# EAGLE design Macropad (EAGLE 9.6.2)
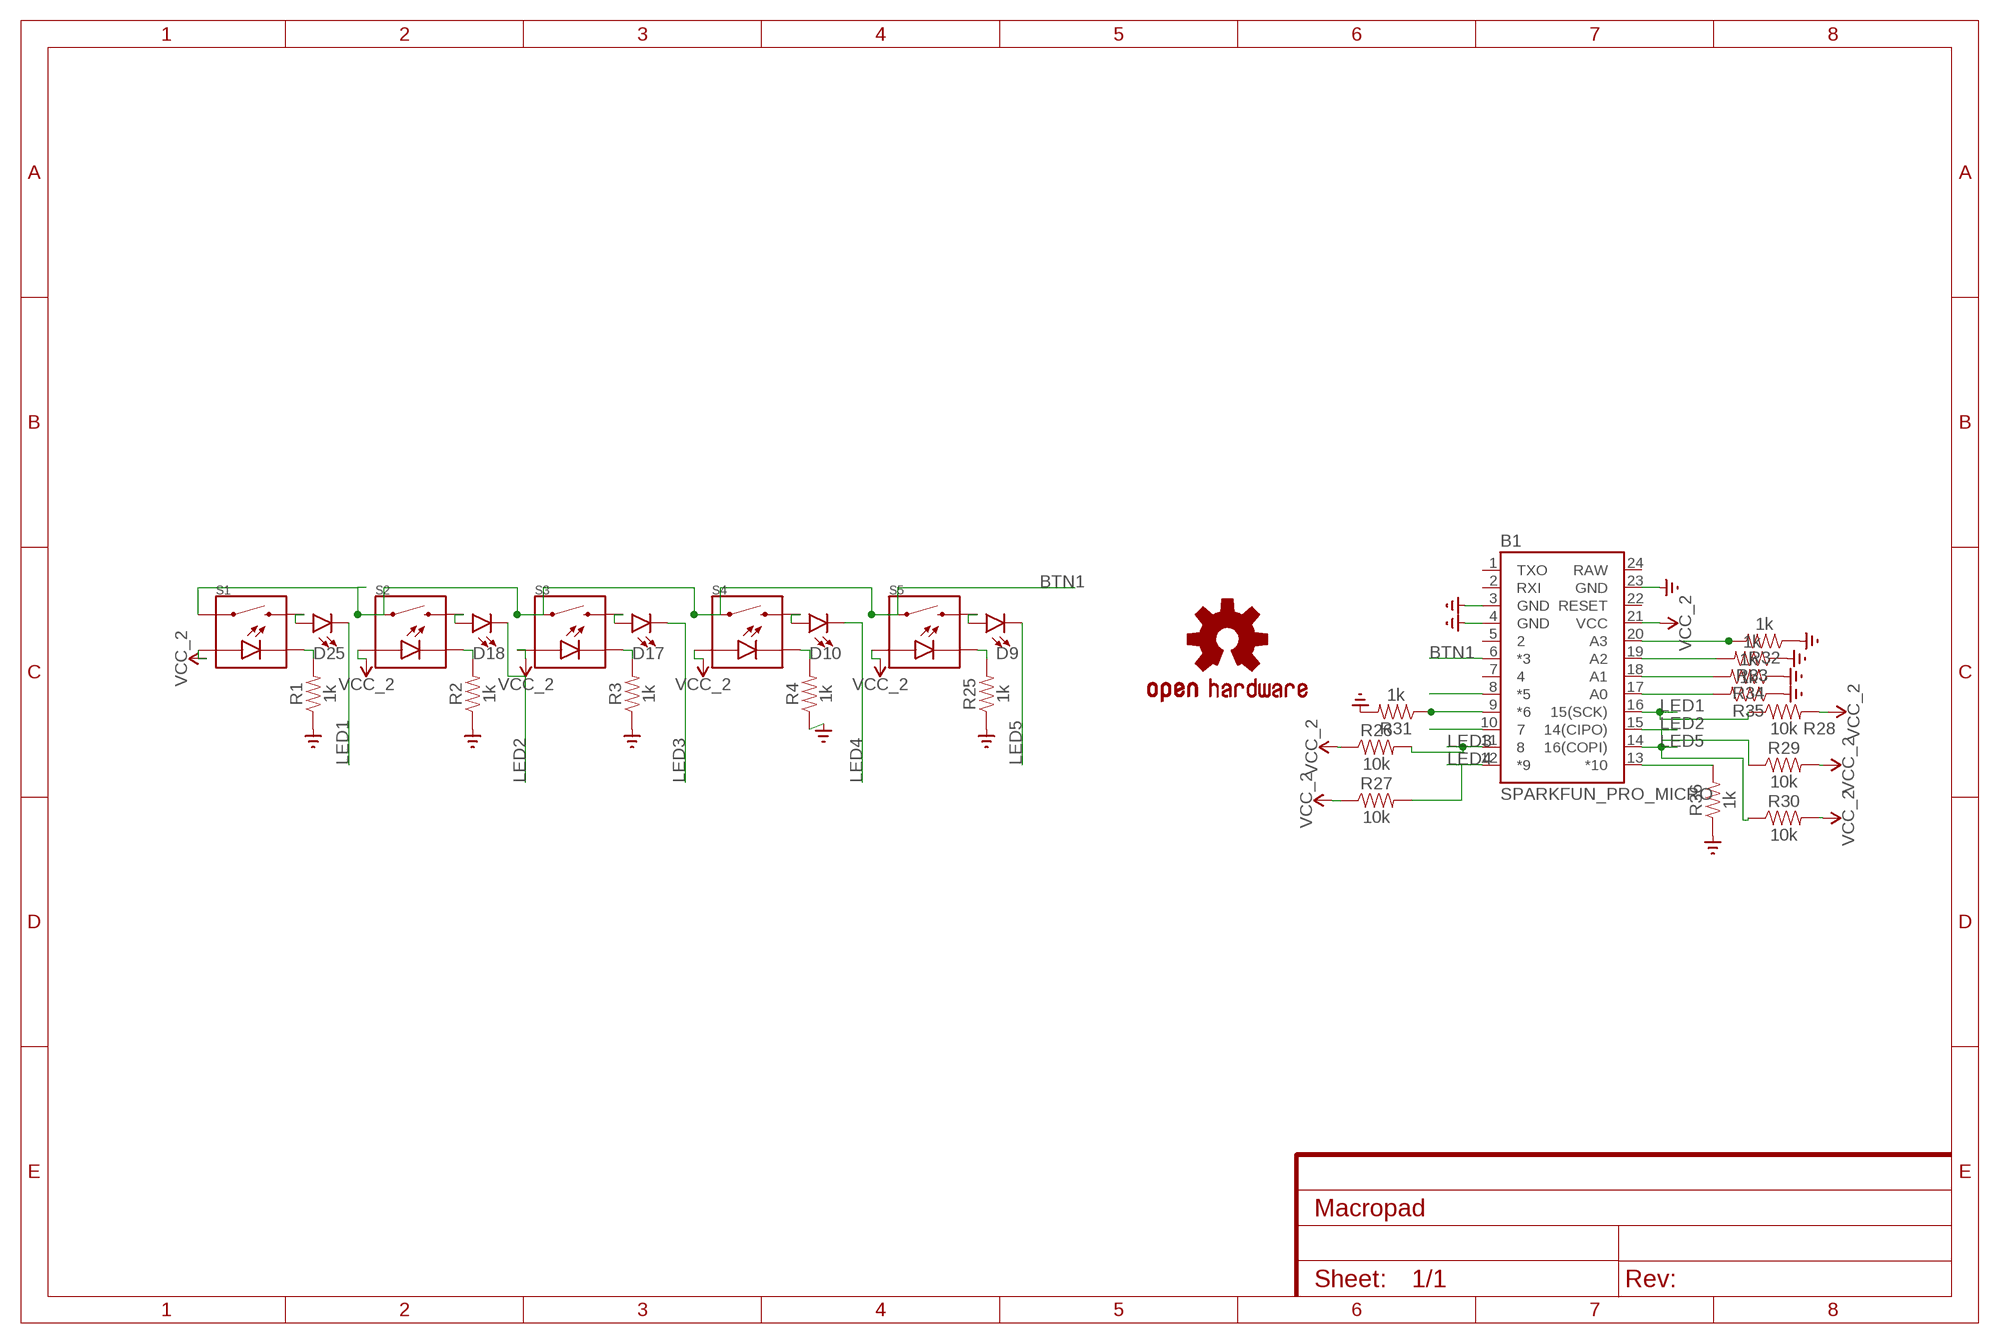
[diagram p0: schematic, sheet 1]

## Parts
B1  SPARKFUN_PRO_MICRO  [SPARKFUN_PRO_MICRO]
D9  LED3MM  [LED_3MM]
D10  LED3MM  [LED_3MM]
D17  LED3MM  [LED_3MM]
D18  LED3MM  [LED_3MM]
D25  LED3MM  [LED_3MM]
LOGO1  OSHW-LOGOM-COPPER  [OSHW-LOGO-M_COPPER]
R1  1k  1KOHM-HORIZ-1/4W-1%  [AXIAL-0.3]
R2  1k  1KOHM-HORIZ-1/4W-1%  [AXIAL-0.3]
R3  1k  1KOHM-HORIZ-1/4W-1%  [AXIAL-0.3]
R4  1k  1KOHM-HORIZ-1/4W-1%  [AXIAL-0.3]
R25  1k  1KOHM-HORIZ-1/4W-1%  [AXIAL-0.3]
R26  10k  10KOHM-HORIZ-1/4W-1%  [AXIAL-0.3]
R27  10k  10KOHM-HORIZ-1/4W-1%  [AXIAL-0.3]
R28  10k  10KOHM-HORIZ-1/4W-1%  [AXIAL-0.3]
R29  10k  10KOHM-HORIZ-1/4W-1%  [AXIAL-0.3]
R30  10k  10KOHM-HORIZ-1/4W-1%  [AXIAL-0.3]
R31  1k  1KOHM-HORIZ-1/4W-1%  [AXIAL-0.3]
R32  1k  1KOHM-HORIZ-1/4W-1%  [AXIAL-0.3]
R33  1k  1KOHM-HORIZ-1/4W-1%  [AXIAL-0.3]
R34  1k  1KOHM-HORIZ-1/4W-1%  [AXIAL-0.3]
R35  1k  1KOHM-HORIZ-1/4W-1%  [AXIAL-0.3]
R36  1k  1KOHM-HORIZ-1/4W-1%  [AXIAL-0.3]
S1  1POLE-FIXPINS-W/LED  [1POLE-FIXPINS-W/LED-EASYSOLDER]
S2  1POLE-FIXPINS-W/LED  [1POLE-FIXPINS-W/LED-EASYSOLDER]
S3  1POLE-FIXPINS-W/LED  [1POLE-FIXPINS-W/LED-EASYSOLDER]
S4  1POLE-FIXPINS-W/LED  [1POLE-FIXPINS-W/LED-EASYSOLDER]
S5  1POLE-FIXPINS-W/LED  [1POLE-FIXPINS-W/LED-EASYSOLDER]

## Nets
BTN1: B1.6(*3) S1.1 S2.1 S3.1 S4.1 S5.1
GND: B1.3(GND) B1.4(GND) B1.23(GND) R1.P$1 R2.P$1 R3.P$1 R4.P$1 R25.P$1 R31.P$2 R32.P$1 R33.P$1 R34.P$1 R35.P$1 R36.P$1 ; supply symbol labelled SUPPLY0_GND_
LED1: B1.16(15(SCK)) D25.K(C) R28.P$1
LED2: B1.15(14(CIPO)) D18.K(C) R29.P$1
LED3: B1.11 D17.K(C) R26.P$2
LED4: B1.12(*9) D10.K(C) R27.P$2
LED5: B1.14(16(COPI)) D9.K(C) R30.P$1
N$1: R1.P$2 S1.4
N$2: R2.P$2 S2.4
N$3: R3.P$2 S3.4
N$4: R4.P$2 S4.4
N$5: R25.P$2 S5.4
N$46: D25.A S1.2
N$47: D18.A S2.2
N$48: D17.A S3.2
N$49: D10.A S4.2
N$50: D9.A S5.2
N$57: B1.9(*6) R31.P$1
N$58: B1.10
N$61: B1.20(A3) R32.P$2
N$62: B1.19(A2) R33.P$2
N$63: B1.18(A1) R34.P$2
N$64: B1.17(A0) R35.P$2
N$65: B1.13(*10) R36.P$2
NET,: B1.8(*5)
VCC_2: B1.21(VCC) R26.P$1 R27.P$1 R28.P$2 R29.P$2 R30.P$2 S1.3 S2.3 S3.3 S4.3 S5.3
Unconnected: B1.1(TXO) B1.2(RXI) B1.5 B1.7 B1.22(RESET)

## Power pins joined to a net without a drawn wire
RAW: B1.24(RAW)

## Library data of the parts
B1 = SparkFun-Boards:SPARKFUN_PRO_MICRO: SparkFun Pro Micro Atmega32U4 compatible footprint. SparkFun Products: 3.3V/8MHz <https://www.sparkfun.com/products/12587> 5V/16MHz <https://www.sparkfun.com/products/12640>
D9 D10 D17 D18 D25 = SparkFun-LED:LED: LED (Generic) Standard schematic elements and footprints for 5mm, 3mm, 1206, and 0603 sized LEDs. Generic LEDs with no color specified.; PROD_ID: DIO-08794
LOGO1 = SparkFun-Aesthetics:OSHW-LOGO: Open-Source Hardware (OSHW) Logo This logo indicates the piece of hardware it is found on incorporates a OSHW license and/or adheres to the definition of open source hardware found here: http://freedomdefined.org/OSHW
R1-R4 R25 R31-R36 = SparkFun-Resistors:1KOHM: 1kΩ resistor A resistor is a passive two-terminal electrical component that implements electrical resistance as a circuit element. Resistors act to reduce current flow, and, at the same time, act to lower voltage levels within circuits. - Wikipedia; PROD_ID: RES-12182
R26-R30 = SparkFun-Resistors:10KOHM: 10kΩ resistor A resistor is a passive two-terminal electrical component that implements electrical resistance as a circuit element. Resistors act to reduce current flow, and, at the same time, act to lower voltage levels within circuits. - Wikipedia; PROD_ID: RES-12183
S1-S5 = OmerFarukUcar-Switches:1POLE-FIXPINS-W/LED

## Board
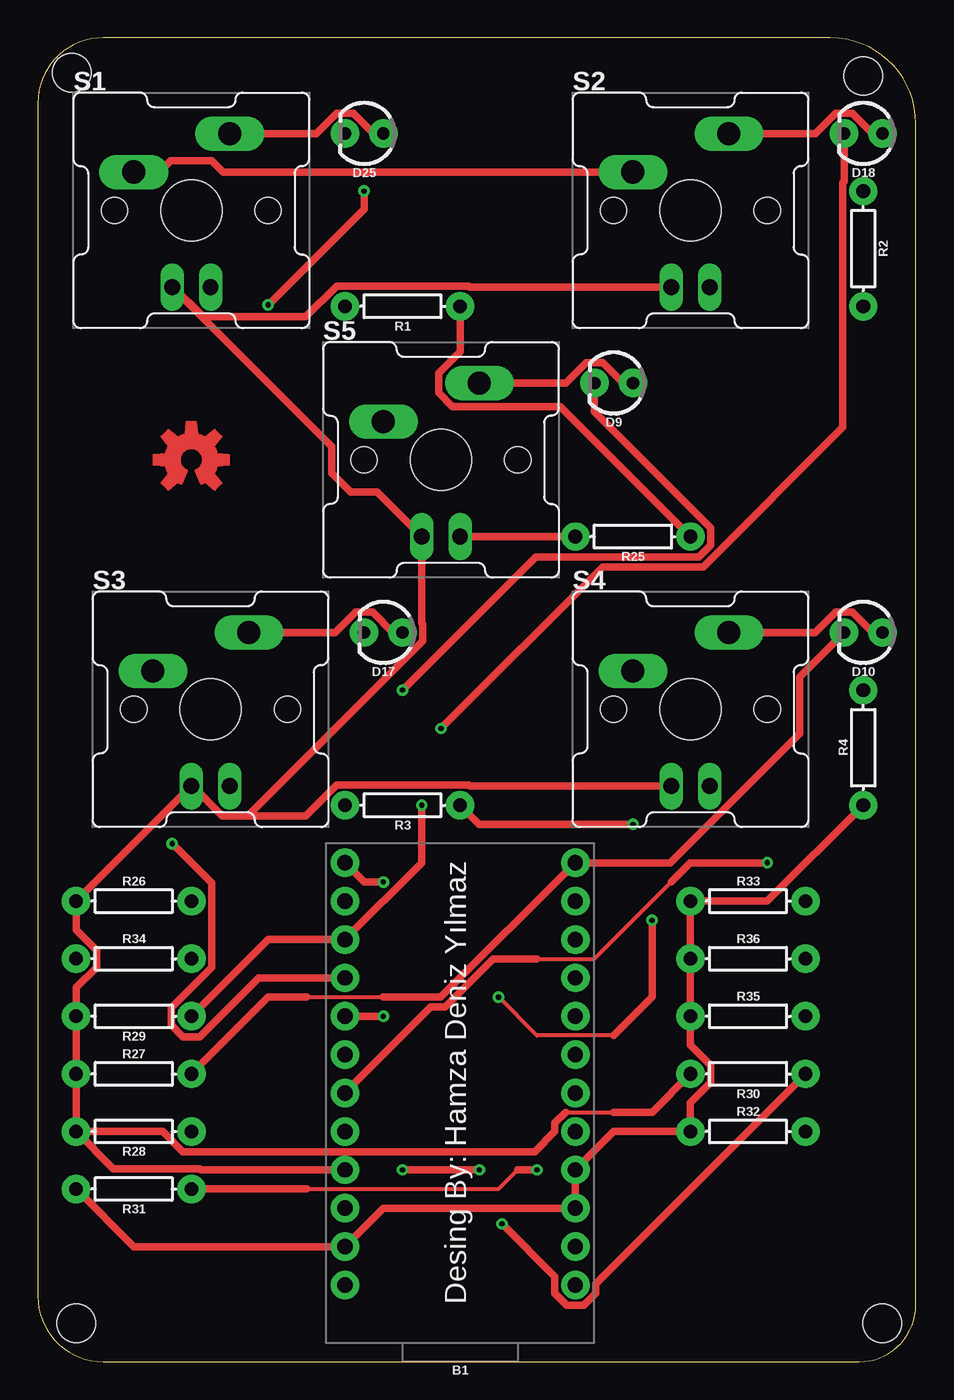
[diagram p1: board, top side]
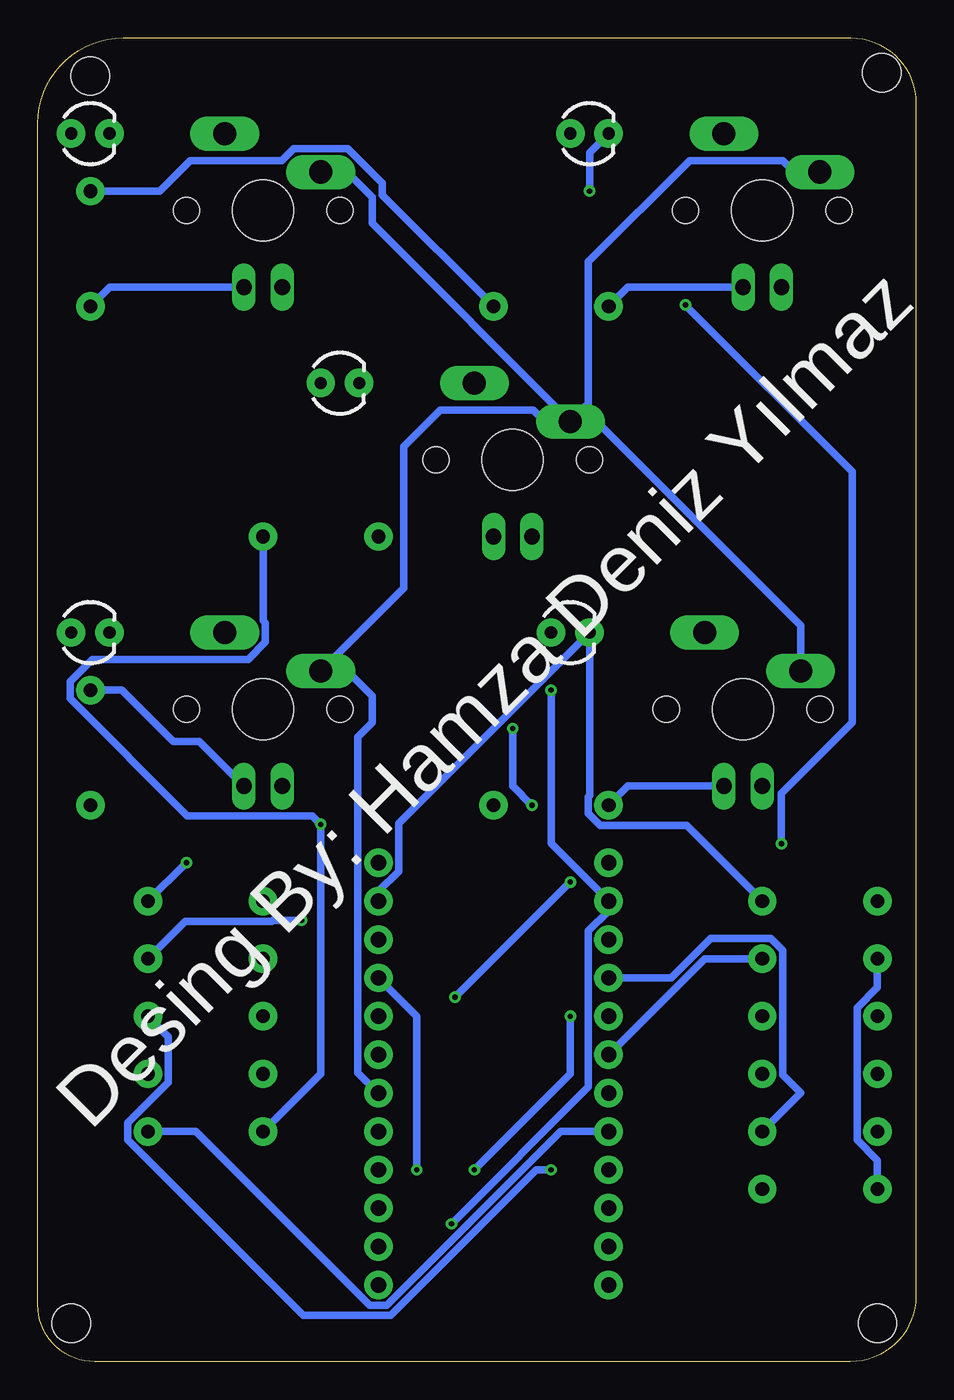
[diagram p2: board, bottom side, seen from below]

Size 58.09 x 87.62 mm. Coordinates in mm from the lower left corner, seen from the top.
Outline: 0,83.3 0,4.34 arc90 4.34,0 54.33,0 arc90 58.09,3.75 58.09,81.97 arc90 52.44,87.62 4.32,87.62 arc90 0,83.3
Copper layers (1*16): Top 0.035mm / dielectric 1.5mm / Bottom 0.035mm
Design rules "default": minimum track width 6mil, minimum drill 0.35mm, track to track 6mil, track to pad 6mil, pad to pad 6mil, via to via 6mil, smd to smd 6mil, copper to edge 40mil, drill to drill 6mil, minimum pad ring 10mil, minimum via ring 8mil, stop-mask expansion 4mil, vias tented up to drill 0mil, thermal gap 10mil
Holes 2.54 mm at 55.88,2.54 54.61,85.09 2.25,85.31 2.54,2.54

### Footprints (pad centres in the part's own frame; a part is rotated, then mirrored left to right if it is on the bottom)
SPARKFUN_PRO_MICRO = drill 1.016 pad 1.88: 1 -7.62,12.7; 2 -7.62,10.16; 3 -7.62,7.62; 4 -7.62,5.08; 5 -7.62,2.54; 6 -7.62,0; 7 -7.62,-2.54; 8 -7.62,-5.08; 9 -7.62,-7.62; 10 -7.62,-10.16; 11 -7.62,-12.7; 12 -7.62,-15.24; 13 7.62,-15.24; 14 7.62,-12.7; 15 7.62,-10.16; 16 7.62,-7.62; 17 7.62,-5.08; 18 7.62,-2.54; 19 7.62,0; 20 7.62,2.54; 21 7.62,5.08; 22 7.62,7.62; 23 7.62,10.16; 24 7.62,12.7
LED_3MM = drill 0.813 pad 1.88: A -1.27,0; K 1.27,0
AXIAL-0.3 = drill 0.9 pad 1.88: P$1 -3.81,0; P$2 3.81,0
1POLE-FIXPINS-W/LED-EASYSOLDER = drill 1.524 long: 1 -3.81,2.54; 2 2.54,5.08 | drill 1.041 long: 3 -1.27,-5.08; 4 1.27,-5.08 | hole 4.039: 0,0 | hole 1.727: -5.08,0; 5.08,0

### Placement (x,y rotation side)
B1  27.94,17.78 180 top
D9  38.1,64.77 180 top
D10  54.61,48.26 180 top
D17  22.86,48.26 180 top
D18  54.61,81.28 180 top
D25  21.59,81.28 180 top
LOGO1  10.16,59.69 0 top
R1  24.13,69.85 180 top
R2  54.61,73.66 270 top
R3  24.13,36.83 180 top
R4  54.61,40.64 90 top
R25  39.37,54.61 180 top
R26  6.35,30.48 0 top
R27  6.35,19.05 0 top
R28  6.35,15.24 180 top
R29  6.35,22.86 180 top
R30  46.99,19.05 180 top
R31  6.35,11.43 180 top
R32  46.99,15.24 0 top
R33  46.99,30.48 0 top
R34  6.35,26.67 0 top
R35  46.99,22.86 0 top
R36  46.99,26.67 0 top
S1  10.16,76.2 0 top
S2  43.18,76.2 0 top
S3  11.43,43.18 0 top
S4  43.18,43.18 0 top
S5  26.67,59.69 0 top

### Tracks (layer width: path | path; a pad name or v marks a point on that pad's centre or on a via)
BTN1
  Top 0.508: S1.1 8.05,78.74 8.8,79.49 11.52,79.49 12.27,78.74 S2.1
  Bottom 0.508: S5.1 24.56,62.23 25.31,62.98 31.48,62.98 33.88,60.57 33.88,51.21 S4.1 38.96,45.31 37.22,45.31 35.97,44.06 35.97,42.3 36.91,41.36 36.91,19.13 B1.6 | S5.1 22.45,61.82 20.71,61.82 7.62,48.74 S3.1 | S1.1 8.05,78.74 8.8,79.49 14.97,79.49 21.67,72.79 21.67,63.42 S5.1 | S5.1 35.97,75.34 35.97,77.08 37.22,78.33 38.96,78.33 S2.1
GND  (via drill 0.35)
  Top 0.508: R25.P$1 34.57,63.22 27.42,63.22 26.52,64.13 26.52,65.41 27.94,66.83 R1.P$1 | R31.P$2 6.35,7.62 B1.23 22.86,10.16 B1.3 B1.4 38.1,15.24 R32.P$1 43.18,17.15 44.53,18.49 44.53,19.61 43.18,20.95 R35.P$1 R36.P$1 R33.P$1 48.26,30.48 R4.P$1 | v39.37,35.56 29.21,35.56 R3.P$1
  Bottom 0.508: R1.P$1 35.31,77.22 35.31,78.01 37.59,80.29 41.16,80.29 41.95,79.49 47.99,79.49 50.01,77.47 R2.P$1 | R32.P$1 39.37,19.05 v39.37,35.56 39.94,36.13 48.2,36.13 55.96,43.89 55.96,45.01 54.5,46.47 44.18,46.47 43.03,47.62 43.03,48.9 43.18,49.05 R25.P$1 | R34.P$1 2.54,24.76 3.89,23.42 3.89,14.68 2.54,13.34 R31.P$2
LED1  (via drill 0.35)
  Top 0.508: v8.89,34.29 11.51,31.67 11.51,26.11 8.81,23.42 8.81,22.3 9.6,21.51 10.72,21.51 14.6,25.4 B1.16 | v15.24,69.94 21.59,76.29 v21.59,77.47
  Bottom 0.508: B1.16 16.17,25.4 13.56,28.02 9.6,28.02 8.81,27.23 8.81,18.97 7.62,17.78 R28.P$1 | v8.89,34.29 8.89,37.62 4.22,42.3 4.22,58.91 v15.24,69.94 | v21.59,77.47 21.59,80.01 D25.K
LED2  (via drill 0.35)
  Top 0.508: R29.P$1 15.24,27.94 B1.15 25.4,33.02 v25.4,36.83 | v26.67,41.91 37.36,52.6 44.01,52.6 53.26,61.86 53.26,78.03 53.34,78.1 D18.K
  Bottom 0.508: v25.4,36.83 26.67,38.1 v26.67,41.91
LED3
  Bottom 0.508: R26.P$2 15.16,35.48 20.88,35.48 21.67,36.27 21.67,37.39 21.59,37.46 D17.K 34.21,35.64 34.21,32.46 35.56,31.12 B1.11
LED4
  Top 0.254: 17.78,24.13 22.86,24.13
  Top 0.508: D10.K 50.39,45.31 50.39,41.58 41.83,33.02 B1.12 26.67,24.13 22.86,24.13 | R27.P$2 15.24,24.13 17.78,24.13
LED5  (via drill 0.35)
  Top 0.508: v30.72,9.13 34.21,5.63 34.21,4.52 35,3.73 36.12,3.73 36.91,4.52 36.91,5.16 R30.P$1 | v24.13,44.45 32.94,53.26 43.74,53.26 44.53,54.05 44.53,55.17 36.83,62.86 D9.K
  Bottom 0.508: v30.72,9.13 21.67,18.18 21.67,28.5 20.32,29.84 B1.14 24.13,34.29 v24.13,44.45
N$1
  Bottom 0.508: S1.4 19.05,71.12 R1.P$2
N$2
  Bottom 0.508: S2.4 53.34,71.12 R2.P$2
N$3
  Bottom 0.508: S3.4 19.05,38.1 R3.P$2
N$4
  Bottom 0.508: S4.4 47.4,41.05 49.14,41.05 52.55,44.45 R4.P$2
N$5
  Top 0.508: S5.4 R25.P$2
N$46
  Top 0.508: S1.2 18.42,81.28 19.76,82.63 20.88,82.63 22.22,81.28 D25.A
N$47
  Top 0.508: S2.2 51.44,81.28 52.78,82.63 53.9,82.63 55.24,81.28 D18.A
N$48
  Top 0.508: S3.2 19.69,48.26 21.03,49.61 22.15,49.61 23.49,48.26 D17.A
N$49
  Top 0.508: S4.2 51.44,48.26 52.78,49.61 53.9,49.61 55.24,48.26 D10.A
N$50
  Top 0.508: S5.2 34.93,64.77 36.27,66.12 37.39,66.12 38.73,64.77 D9.A
N$57  (via drill 0.35)
  Top 0.254: 17.78,11.43 30.48,11.43 31.75,12.7
  Top 0.508: R31.P$1 17.78,11.43 | 31.75,12.7 v33.02,12.7
  Bottom 0.508: v33.02,12.7 33.02,22.86 B1.9
N$61
  Bottom 0.508: B1.20 23.5,15.24 35,3.73 36.12,3.73 47.62,15.24 R32.P$2
N$62  (via drill 0.35)
  Top 0.254: 33.02,26.67 36.83,26.67 41.91,31.75
  Top 0.508: B1.19 26.01,23.47 26.94,23.47 30.14,26.67 33.02,26.67 | 41.91,31.75 43.18,33.02 v48.26,33.02
  Bottom 0.508: v48.26,33.02 R33.P$2
N$63
  Bottom 0.508: R34.P$2 13.97,26.67 B1.18
N$64  (via drill 0.35)
  Top 0.508: v24.13,12.7 v29.21,12.7 | v22.86,22.86 B1.17
  Bottom 0.508: v24.13,12.7 25.1,12.7 34.73,3.07 40.54,3.07 52.15,14.68 52.15,15.8 49.45,18.49 49.45,21.51 R35.P$2 | v29.21,12.7 22.86,19.05 v22.86,22.86
N$65  (via drill 0.35)
  Top 0.254: 38.1,21.59 33.02,21.59 v30.48,24.13
  Top 0.508: v40.64,29.21 40.64,24.13 38.1,21.59 | v22.86,31.75 21.59,31.75 B1.13
  Bottom 0.508: v40.64,29.21 42.55,29.21 42.62,29.13 48.34,29.13 R36.P$2 | v30.48,24.13 v22.86,31.75
VCC_2
  Top 0.254: 34.93,16.51 38.1,16.51
  Top 0.508: S2.3 28.57,71.12 28.5,71.2 19.76,71.2 17.72,69.15 10.94,69.15 8.97,71.12 S1.3 19.46,60.55 19.46,58.81 20.71,57.56 22.45,57.56 S5.3 25.4,48.89 25.48,48.82 25.48,47.7 13.91,36.13 | S4.3 28.57,38.1 28.5,38.18 19.76,38.18 17.72,36.13 13.91,36.13 | 13.91,36.13 12.21,36.13 10.24,38.1 S3.3 R26.P$1 2.54,28.57 3.89,27.23 3.89,26.11 2.54,24.77 R29.P$2 R27.P$1 R28.P$2 | B1.21 10.79,12.7 10.72,12.78 5,12.78 R28.P$2 | R28.P$2 8.26,15.24 9.6,13.89 32.87,13.89 34.21,15.24 34.21,15.8 34.93,16.51 | 38.1,16.51 40.64,16.51 R30.P$2

### Text on the board
tNames: Desing By: Hamza Deniz Yılmaz
bNames: Desing By: Hamza Deniz Yılmaz